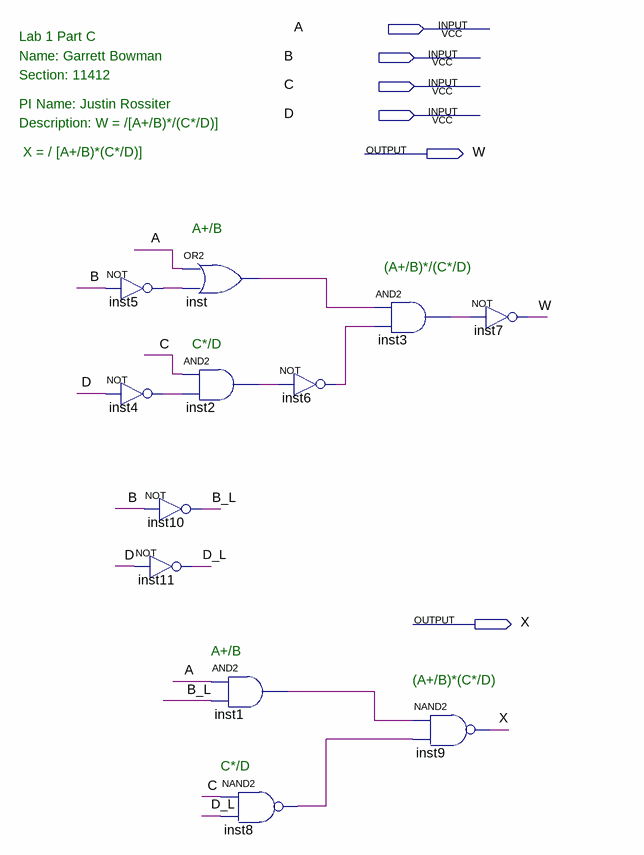
[diagram p0: schematic sheet]
// Quartus schematic Lab1c.bdf as structural Verilog: 12 symbols, 6 pins
module Lab1c (
  input  A,
  input  B,
  input  C,
  input  D,
  output W,
  output X
);

  wire B_L, D_L, inst1_out, inst2_out, inst3_out, inst4_out, inst5_out, inst6_out, inst8_out, inst_out;

  not inst5 (inst5_out, B);
  not inst4 (inst4_out, D);
  not inst10 (B_L, B);
  not inst11 (D_L, D);
  or inst (inst_out, A, inst5_out);
  and inst2 (inst2_out, C, inst4_out);
  and inst1 (inst1_out, A, B_L);
  nand inst8 (inst8_out, C, D_L);
  not inst6 (inst6_out, inst2_out);
  and inst3 (inst3_out, inst_out, inst6_out);
  nand inst9 (X, inst1_out, inst8_out);
  not inst7 (W, inst3_out);

  // Notes on the sheet:
  //   Lab 1 Part C
  //   Name: Garrett Bowman
  //   Section: 11412
  //   PI Name: Justin Rossiter
  //   Description: W = /[A+/B)*/(C*/D)]
  //    X = / [A+/B)*(C*/D)]
  //   A+/B
  //   (A+/B)*/(C*/D)
  //   C*/D
  //   A+/B
  //   (A+/B)*(C*/D)
  //   C*/D
endmodule
